# Altium schematic sheet POWER.SchDoc
size A3
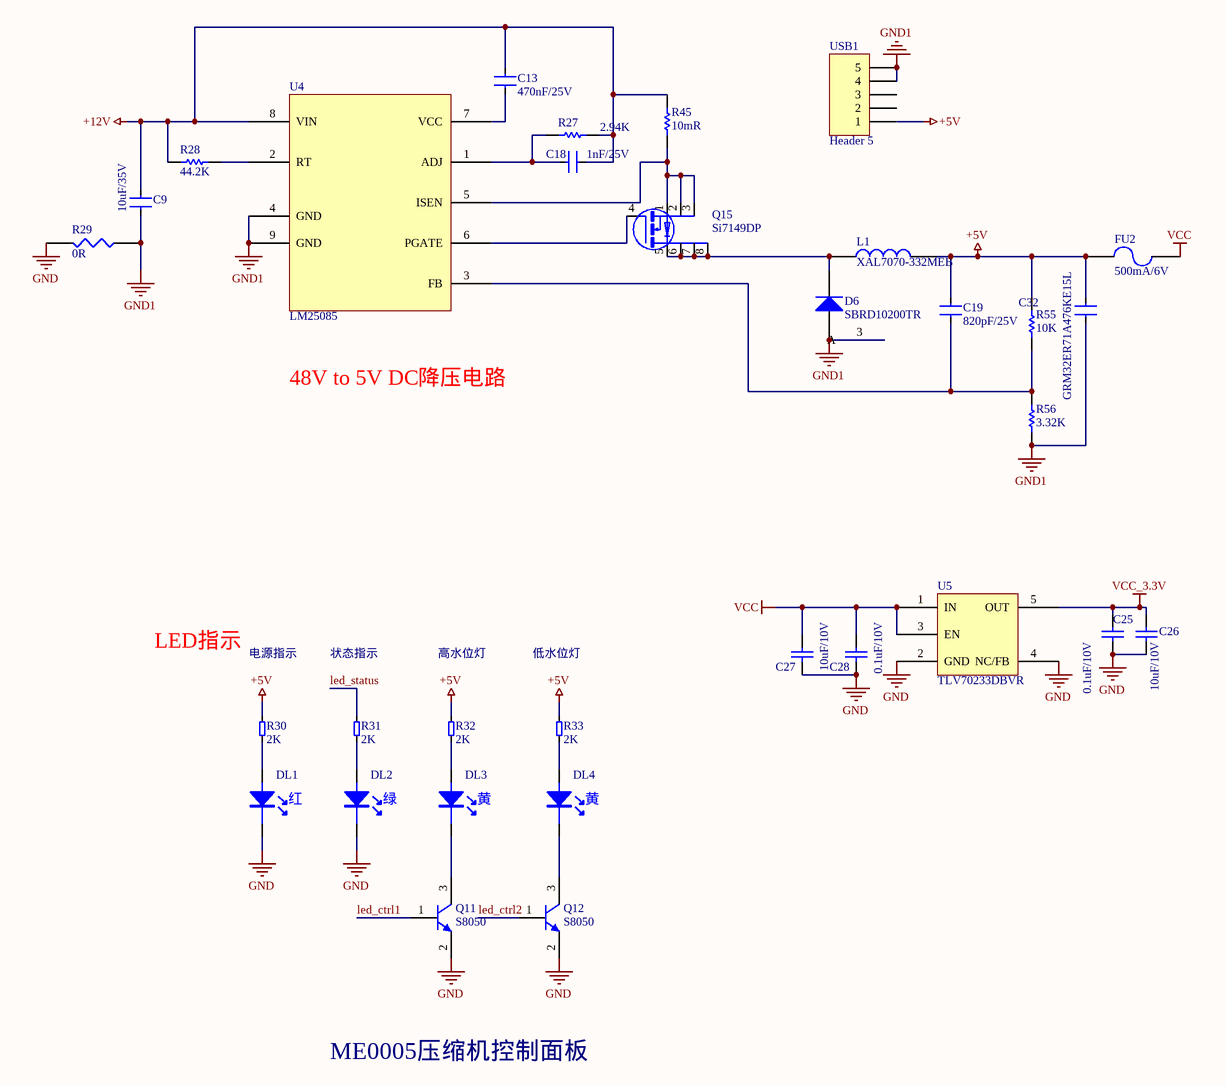
[diagram p0: POWER.SchDoc]

## Parts
C9  10uF/35V  [1210C]
C13  470nF/25V  [0603C]
C18  1nF/25V  [0603C]
C19  820pF/25V  [0603C]
C25  0.1uF/10V  [0603C]
C26  10uF/10V  [0603C]
C27  10uF/10V  [0603C]
C28  0.1uF/10V  [0603C]
C32  GRM32ER71A476KE15L  [1210C]
D6  SBRD10200TR  [TO228P970-3N]
DL1  红  [LED-3]
DL2  绿  [LED-3]
DL3  黄  [LED-3]
DL4  黄  [LED-3]
FU2  500mA/6V  [F0805]
L1  XAL7070-332MEB  [XAL7070]
Q11  S8050  [SOT23-3]
Q12  S8050  [SOT23-3]
Q15  Si7149DP  [PowerPAK SO-8]
R27  2.94K  [0603R]
R28  44.2K  [0603R]
R29  0R  [0805R]
R30  2K  [0805R]
R31  2K  [0805R]
R32  2K  [0805R]
R33  2K  [0805R]
R45  10mR  [1206R]
R55  10K  [0603R]
R56  3.32K  [0603R]
U4  LM25085  [SOP65P490X265_HS-8N]
U5  TLV70233DBVR  [SOT23-5(DBV)]
USB1  Header 5  [USB-A]

## Nets
+5V: C19.1 C32.1 FU2.1 L1.2 R30.2 R32.2 R33.2 R55.1 USB1.1
+12V: C9.1 C13.2 C18.1 R27.1 R28.2 R45.1 U4.8(VIN)
GND: C25.2 C26.1 C27.1 C28.2 DL1.K DL2.K Q11.2(E) Q12.2(E) R29.2 U5.2(GND) U5.4(NC/FB)
GND1: C9.2 C32.2 D6.1(A) D6.3(A) R29.1 R56.2 U4.4(GND) U4.9(GND) USB1.4 USB1.5
VCC: C27.2 C28.1 FU2.2 U5.1(IN) U5.3(EN)
VCC_3.3V: C25.1 C26.2 U5.5(OUT)
led_ctrl1: Q11.1(B)
led_ctrl2: Q12.1(B)
led_status: R31.2
NetC13_1: C13.1 U4.7(VCC)
NetC18_2: C18.2 R27.2 U4.1(ADJ)
NetC19_2: C19.2 R55.2 R56.1 U4.3(FB)
NetD6_2: D6.2(K) L1.1 Q15.5(D) Q15.6(D) Q15.7(D) Q15.8(D)
NetDL1_A: DL1.A R30.1
NetDL2_A: DL2.A R31.1
NetDL3_A: DL3.A R32.1
NetDL3_K: DL3.K Q11.3(C)
NetDL4_A: DL4.A R33.1
NetDL4_K: DL4.K Q12.3(C)
NetQ15_1: Q15.1(S) Q15.2(S) Q15.3(S) R45.2 U4.5(ISEN)
NetQ15_4: Q15.4(G) U4.6(PGATE)
NetR28_1: R28.1 U4.2(RT)

Not connected (* = marked no-connect by the designer): USB1 2 3

## Notes on the sheet
- 48V to 5V DC降压电路
- LED指示
- 电源指示
- 状态指示
- 高水位灯
- 低水位灯
- ME0005压缩机控制面板

## Library data of the parts
C9 C13 C18 C19 C32 = 0.01UF: CCX85-103
C25 C28 = Cap: Capacitor; Value: 104; Published: 8-Jun-2000; LatestRevisionDate: 17-Jul-2002; LatestRevisionNote: Re-released for DXP Platform.; PackageReference: RAD-0.3; Publisher: Altium Limited
C26 = Cap: Capacitor; Published: 8-Jun-2000; LatestRevisionDate: 17-Jul-2002; LatestRevisionNote: Re-released for DXP Platform.; PackageReference: RAD-0.3; Publisher: Altium Limited; Value: 10uF/10V
C27 = Cap: Capacitor; Value: 106/50V; Published: 8-Jun-2000; LatestRevisionDate: 17-Jul-2002; LatestRevisionNote: Re-released for DXP Platform.; PackageReference: RAD-0.3; Publisher: Altium Limited
D6 = Diode_2: Default Diode; Published: 8-Jun-2000; LatestRevisionDate: 17-Jul-2002; LatestRevisionNote: Re-released for DXP Platform.; PackageVersion: Sep-1996; PackageReference: SMC; Publisher: Altium Limited; PackageDescription: DO-214-AB/SMC; 2 C-Bend Leads; Body 7.9 x 5.9 mm, inc. leads (LxW); Code_JEDEC: DO-214-AB
DL1-DL4 = L-7113SRD-D: CP-L-7113SRD-D
FU2 = FUSE2: Fuse
L1 = INDUCTOR
Q11 Q12 = NPN: NPN Bipolar Transistor; Published: 8-Jun-2000; LatestRevisionDate: 17-Jul-2002; LatestRevisionNote: Re-released for DXP Platform.; PackageReference: TO-226; Publisher: Altium Limited; Code_JEDEC: TO-226-AA
Q15 = Si4004DY
R27 R28 R45 R55 R56 = Res Semi: Semiconductor Resistor; Value: 1K; Published: 8-Jun-2000; LatestRevisionDate: 17-Jul-2002; LatestRevisionNote: Re-released for DXP Platform.; PackageReference: AXIAL-0.5; Publisher: Altium Limited
R29 = RES1
R30-R33 = 1K: CR85-102J
U5 = TLV70230DBVR
USB1 = Header 5: Header, 5-Pin; LatestRevisionDate: 17-Jul-2002; LatestRevisionNote: Re-released for DXP Platform.; Publisher: Altium Limited